# Altium schematic sheet 安全回路.SchDoc
size A4; SheetNumber: 4; SheetTotal: 9
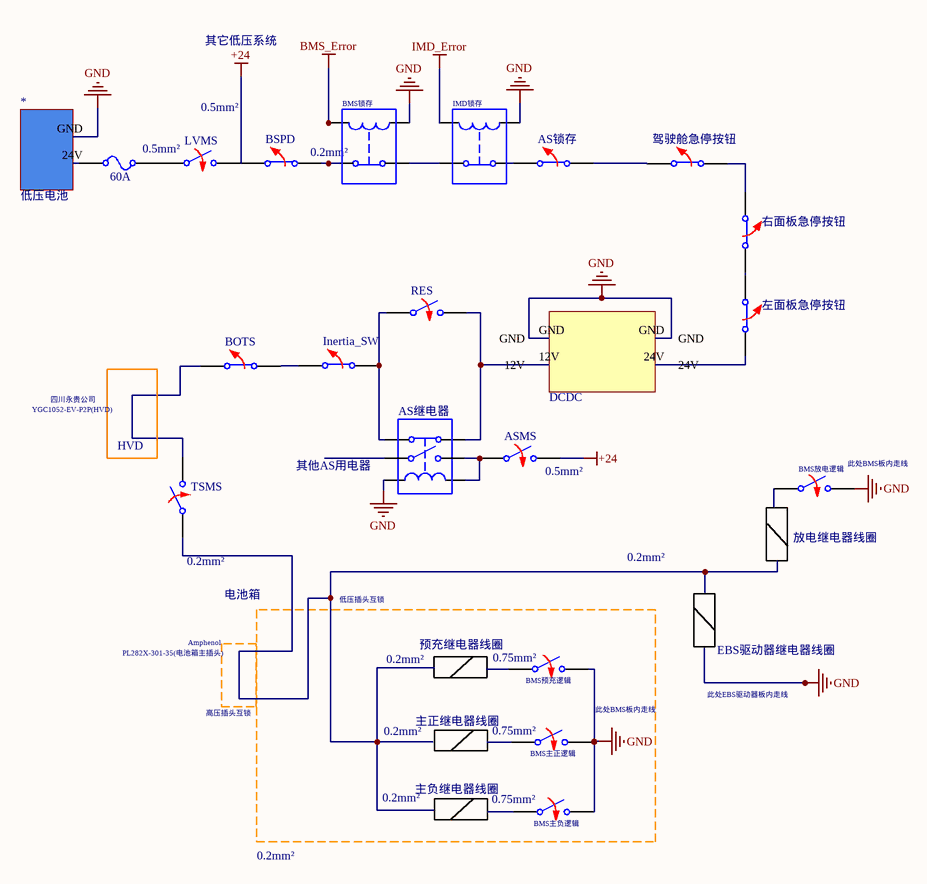
[diagram p0: 安全回路.SchDoc]

## Parts
60A  Fuse  (value not drawn)
*  低压电池
*?  DCDC
ASMS  Switch Normally Opened  (value not drawn)
AS继电器  Single-Pole, Single-Throw Normally Closed Relay  (value not drawn)
AS锁存  Switch Normally Closed  (value not drawn)
BMS主正逻辑  Switch Normally Opened  (value not drawn)
BMS主负逻辑  Switch Normally Opened  (value not drawn)
BMS放电逻辑  Switch Normally Opened  (value not drawn)
BMS锁存  Single-Pole, Single-Throw Normally Closed Relay  (value not drawn)
BMS预充逻辑  Switch Normally Opened  (value not drawn)
BOTS  Switch Normally Closed  (value not drawn)
BSPD  Switch Normally Closed  (value not drawn)
IMD锁存  Single-Pole, Single-Throw Normally Closed Relay  (value not drawn)
Inertia_SW  Switch Normally Closed  (value not drawn)
LVMS  Switch Normally Opened  (value not drawn)
RES  Switch Normally Opened  (value not drawn)
S?  Single-Pole, Single-Throw Switch  (value not drawn)
TSMS  Switch Normally Opened  (value not drawn)
右面板急停按钮  Switch Normally Closed  (value not drawn)
左面板急停按钮  Switch Normally Closed  (value not drawn)
驾驶舱急停按钮  Switch Normally Closed  (value not drawn)

## Sub-sheets
电池箱 = YGC1052-EV-P2P(HVD): no entries

## Nets
+24: ASMS.2 BSPD.1 LVMS.2
BMS_Error: BMS锁存.4
GND: *.GND *?.GND AS继电器.3 BMS主正逻辑.2 BMS主负逻辑.2 BMS放电逻辑.2 BMS锁存.3 BMS预充逻辑.2 IMD锁存.3
IMD_Error: IMD锁存.4
Net60A_1: 60A.1 *.24V
Net60A_2: 60A.2 LVMS.1
Net*?_12V: *?.12V AS继电器.2 RES.2
Net*?_24V: *?.24V 左面板急停按钮.2
NetASMS_1: ASMS.1 AS继电器.4 S?.2
NetAS继电器_1: AS继电器.1 Inertia_SW.2 RES.1
NetAS锁存_2: AS锁存.2 驾驶舱急停按钮.1
NetBMS锁存_1: BMS锁存.1 IMD锁存.2
NetBMS锁存_2: BMS锁存.2 BSPD.2
NetBOTS_1: BOTS.1 TSMS.2
NetBOTS_2: BOTS.2 Inertia_SW.1
Net右面板急停按钮_1: 右面板急停按钮.1 驾驶舱急停按钮.2
Net右面板急停按钮_2: 右面板急停按钮.2 左面板急停按钮.1

Not connected (* = marked no-connect by the designer): AS锁存 1; BMS主正逻辑 1; BMS主负逻辑 1; BMS放电逻辑 1; BMS预充逻辑 1; IMD锁存 1; S? 1; TSMS 1

## Notes on the sheet
- 其它低压系统
- 0.5mm²
- (near BMS锁存) 0.2mm²
- 四川永贵公司
- HVD
- (near BMS放电逻辑) 此处BMS板内走线
- 其他AS用电器
- (near ASMS) 0.5mm²
- (near TSMS) 0.2mm²
- 电池箱
- 低压插头互锁
- 0.2mm²
- (near BMS放电逻辑) 放电继电器线圈
- PL282X-301-35(电池箱主插头)
- Amphenol
- 预充继电器线圈
- (near BMS预充逻辑) 0.75mm²
- EBS驱动器继电器线圈
- 高压插头互锁
- 主正继电器线圈
- (near BMS主正逻辑) 0.75mm²
- 此处BMS板内走线
- 此处EBS驱动器板内走线
- 主负继电器线圈
- (near BMS主负逻辑) 0.75mm²

## Library data of the parts
60A = Fuse: RESISTANCE: 1m; SimulationGenericComponent: True; CURRENT: 1
ASMS BMS主正逻辑 BMS主负逻辑 BMS放电逻辑 BMS预充逻辑 LVMS RES TSMS = SW NO: closed: 0; Rclosed: 1m; Ropen: 1Meg; SimulationGenericComponent: True
AS继电器 BMS锁存 IMD锁存 = SPST Relay NC: L_C: 1u; R_C: 100; RON: 1; ROFF: 1e12; ION: 1m; IOFF: 0; SimulationGenericComponent: True
AS锁存 BOTS BSPD Inertia_SW 右面板急停按钮 左面板急停按钮 驾驶舱急停按钮 = SW NC: closed: 1; Rclosed: 1m; Ropen: 1Meg; SimulationGenericComponent: True
S? = SPST SW: closed: 0; Rclosed: 1m; Ropen: 1Meg; SimulationGenericComponent: True